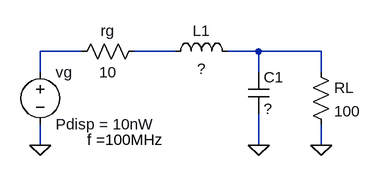
[diagram p0: schematic eje1_sch.asc]
eje1_sch.asc, the LTspice schematic file:
Version 4
SHEET 1 880 680
WIRE 16 96 -48 96
WIRE 160 96 96 96
WIRE 288 96 240 96
WIRE 384 96 288 96
WIRE -48 128 -48 96
WIRE 288 128 288 96
WIRE 384 128 384 96
WIRE -48 240 -48 208
WIRE 288 240 288 192
WIRE 384 240 384 208
FLAG -48 240 0
FLAG 288 240 0
FLAG 384 240 0
SYMBOL voltage -48 112 R0
SYMATTR InstName vg
SYMATTR Value Pdisp = 10nW
SYMBOL res 112 80 R90
WINDOW 0 0 56 VBottom 2
WINDOW 3 32 56 VTop 2
SYMATTR InstName rg
SYMATTR Value 10
SYMBOL ind 144 112 R270
WINDOW 0 32 56 VTop 2
WINDOW 3 5 56 VBottom 2
SYMATTR InstName L1
SYMATTR Value ?
SYMBOL cap 272 128 R0
SYMATTR InstName C1
SYMATTR Value ?
SYMBOL res 368 112 R0
SYMATTR InstName RL
SYMATTR Value 100
TEXT 24 232 Left 2 !f =100MHz

The netlist it stands for:
* eje1_sch.asc
vg N001 0 Pdisp = 10nW
rg N002 N001 10
L1 N002 N003 ?
C1 N003 0 ?
RL N003 0 100
f =100MHz
.backanno
.end